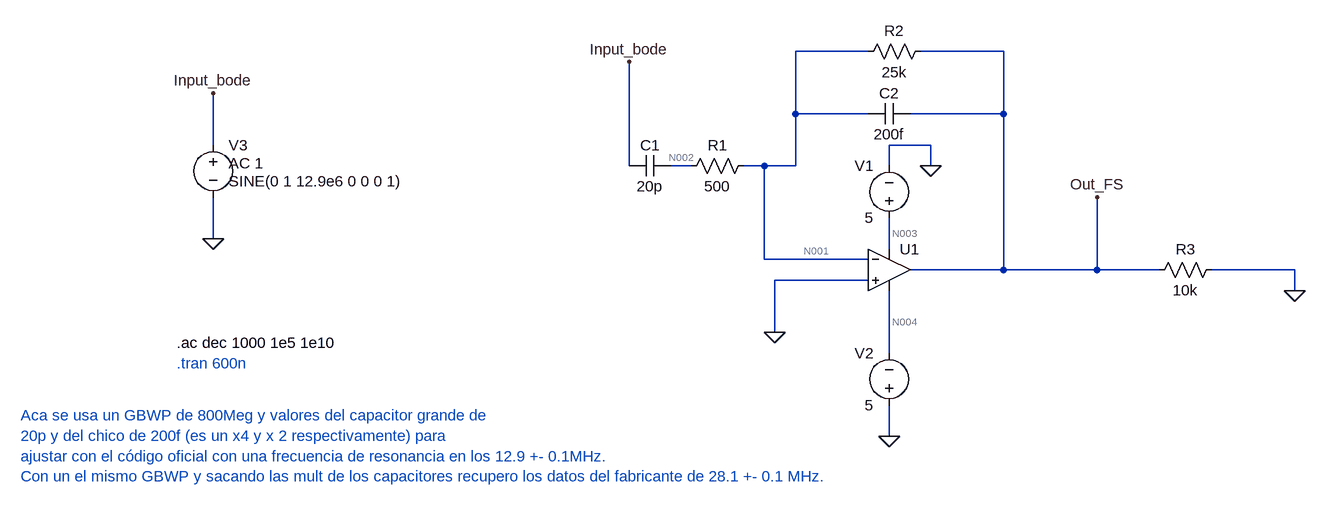
[diagram p0: schematic Bode+sine_fastshaper.asc]
Bode+sine_fastshaper.asc, the LTspice schematic file:
Version 4
SHEET 1 880 680
WIRE -16 -144 -128 -144
WIRE 192 -144 64 -144
WIRE -128 -48 -128 -144
WIRE -16 -48 -128 -48
WIRE 192 -48 192 -144
WIRE 192 -48 48 -48
WIRE -1024 0 -1024 -80
WIRE 80 0 16 0
WIRE -384 32 -384 -128
WIRE -288 32 -320 32
WIRE -176 32 -208 32
WIRE -128 32 -128 -48
WIRE -128 32 -176 32
WIRE 16 32 16 0
WIRE 80 32 80 0
WIRE -1024 144 -1024 80
WIRE 16 160 16 112
WIRE -176 176 -176 32
WIRE -16 176 -176 176
WIRE 192 192 192 -48
WIRE 192 192 48 192
WIRE 336 192 336 80
WIRE 336 192 192 192
WIRE 432 192 336 192
WIRE 640 192 512 192
WIRE -16 208 -160 208
WIRE 640 224 640 192
WIRE -160 288 -160 208
WIRE 16 320 16 224
WIRE 16 448 16 400
FLAG 16 448 0
FLAG 80 32 0
FLAG -160 288 0
FLAG 336 80 Out_FS
FLAG 640 224 0
FLAG -384 -128 Input_bode
FLAG -1024 144 0
FLAG -1024 -80 Input_bode
SYMBOL res -192 16 R90
WINDOW 0 0 56 VBottom 2
WINDOW 3 32 56 VTop 2
SYMATTR InstName R1
SYMATTR Value 500
SYMBOL res 80 -160 R90
WINDOW 0 0 56 VBottom 2
WINDOW 3 32 56 VTop 2
SYMATTR InstName R2
SYMATTR Value 25k
SYMBOL voltage 16 128 R180
WINDOW 0 24 96 Left 2
WINDOW 3 24 16 Left 2
WINDOW 123 0 0 Left 0
WINDOW 39 0 0 Left 0
SYMATTR InstName V1
SYMATTR Value 5
SYMBOL voltage 16 416 R180
WINDOW 0 24 96 Left 2
WINDOW 3 24 16 Left 2
WINDOW 123 0 0 Left 0
WINDOW 39 0 0 Left 0
SYMATTR InstName V2
SYMATTR Value 5
SYMBOL OpAmps\\UniversalOpAmp1 16 192 R0
SYMATTR InstName U1
SYMATTR Value2 Avol=1Meg GBW=800Meg Vos=0
SYMBOL res 528 176 R90
WINDOW 0 0 56 VBottom 2
WINDOW 3 32 56 VTop 2
SYMATTR InstName R3
SYMATTR Value 10k
SYMBOL cap -320 16 R90
WINDOW 0 0 32 VBottom 2
WINDOW 3 32 32 VTop 2
SYMATTR InstName C1
SYMATTR Value 20p
SYMBOL cap 48 -64 R90
WINDOW 0 0 32 VBottom 2
WINDOW 3 32 32 VTop 2
SYMATTR InstName C2
SYMATTR Value 200f
SYMBOL voltage -1024 -16 R0
WINDOW 123 24 44 Left 2
WINDOW 39 0 0 Left 0
WINDOW 3 24 72 Left 2
SYMATTR Value2 AC 1
SYMATTR Value SINE(0 1 12.9e6 0 0 0 1)
SYMATTR InstName V3
TEXT -1080 336 Left 2 ;.tran 600n
TEXT -1080 304 Left 2 !.ac dec 1000 1e5 1e10
TEXT -1320 416 Left 2 ;Aca se usa un GBWP de 800Meg y valores del capacitor grande de\n20p y del chico de 200f (es un x4 y x 2 respectivamente) para \najustar con el código oficial con una frecuencia de resonancia en los 12.9 +- 0.1MHz.\nCon un el mismo GBWP y sacando las mult de los capacitores recupero los datos del fabricante de 28.1 +- 0.1 MHz.

The netlist it stands for:
* Bode+sine_fastshaper.asc
R1 N001 N002 500
R2 Out_FS N001 25k
V1 N003 0 5
V2 0 N004 5
XU1 0 N001 N003 N004 Out_FS level1 Avol=1Meg GBW=800Meg Vos=0 En=0 Enk=0 In=0 Ink=0 Rin=500Meg  ; pins In+ In- V+ V- OUT
R3 0 Out_FS 10k
C1 N002 Input_bode 20p
C2 Out_FS N001 200f
V3 Input_bode 0 SINE(0 1 12.9e6 0 0 0 1) AC 1
* .tran 600n
.ac dec 1000 1e5 1e10
* Aca se usa un GBWP de 800Meg y valores del capacitor grande de
* 20p y del chico de 200f (es un x4 y x 2 respectivamente) para
* ajustar con el código oficial con una frecuencia de resonancia en los 12.9 +- 0.1MHz.
* Con un el mismo GBWP y sacando las mult de los capacitores recupero los datos del fabricante de 28.1 +- 0.1 MHz.
.lib UniversalOpAmp1.lib
.backanno
.end

* Results of the author's LTspice run, read from the files saved beside the schematic
* Operating Point, zero values left out:
*   V(n003) = 5 V
*   V(n004) = -5 V
*   I(V1) = -10 nA
*   I(V2) = -10 nA
*   Ix(u1:3) = 10 nA
*   Ix(u1:4) = -10 nA
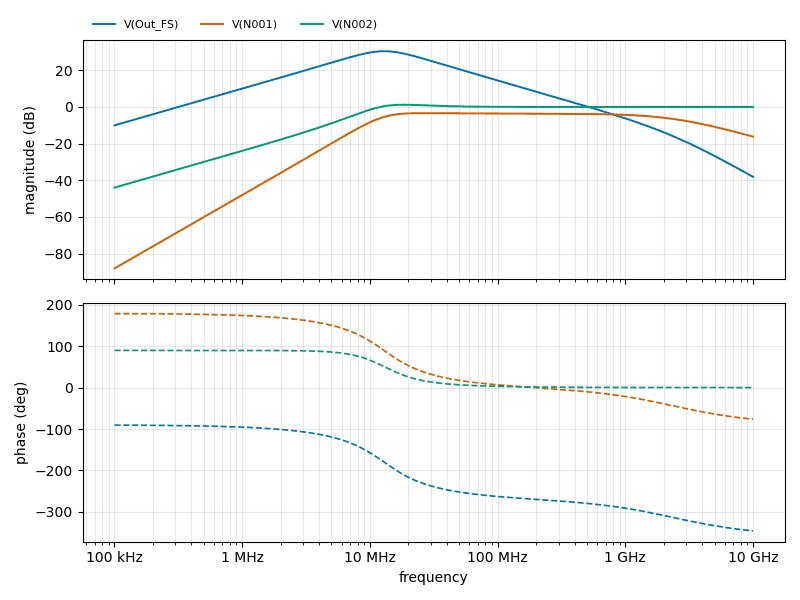
[diagram p1: AC Analysis of Bode+sine_fastshaper.asc, plotted from the saved traces]
* AC Analysis, 1 run:
*   V(Out_FS): -10.06 dB at 100 kHz, -38.15 dB at 10 GHz, peak 30.38 dB at 12.94 MHz, 3 dB below the peak at 7.23 MHz and 23.13 MHz
*   V(N001): -88.12 dB at 100 kHz, -16.21 dB at 10 GHz, peak -3.39 dB at 26.18 MHz, 3 dB below the peak at 11.74 MHz and 2.275 GHz
*   V(N002): -44.04 dB at 100 kHz, -0.00 dB at 10 GHz, peak 1.18 dB at 18.37 MHz, 3 dB below the peak at 9.694 MHz